# Altium schematic sheet Y.SchDoc
size A4
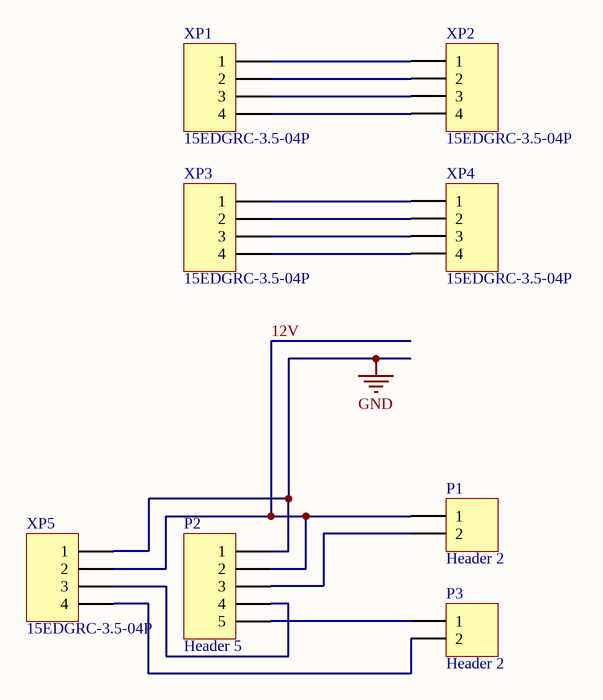
[diagram p0: Y.SchDoc]

## Parts
P1  Header 2  [HDR1X2]
P2  Header 5  [HDR1X5]
P3  Header 2  [HDR1X2]
XP1  15EDGRC-3.5-04P  [RR_CONN_15EDGRC-3.5-04P]
XP2  15EDGRC-3.5-04P  [RR_CONN_15EDGRC-3.5-04P]
XP3  15EDGRC-3.5-04P  [RR_CONN_15EDGRC-3.5-04P]
XP4  15EDGRC-3.5-04P  [RR_CONN_15EDGRC-3.5-04P]
XP5  15EDGRC-3.5-04P  [RR_CONN_15EDGRC-3.5-04P]

## Nets
GND: P2.1 XP5.1
12V: P1.1 P2.2 XP5.2
NetP1_2: P1.2 P2.3
NetP2_4: P2.4 XP5.3
NetP2_5: P2.5 P3.1
NetP3_2: P3.2 XP5.4
NetXP1_1: XP1.1 XP2.1
NetXP1_2: XP1.2 XP2.2
NetXP1_3: XP1.3 XP2.3
NetXP1_4: XP1.4 XP2.4
NetXP3_1: XP3.1 XP4.1
NetXP3_2: XP3.2 XP4.2
NetXP3_3: XP3.3 XP4.3
NetXP3_4: XP3.4 XP4.4

## Library data of the parts
P1 P3 = Header 2: Header, 2-Pin; LatestRevisionDate: 17-Jul-2002; LatestRevisionNote: Re-released for DXP Platform.; Publisher: Altium Limited
P2 = Header 5: Header, 5-Pin; LatestRevisionDate: 17-Jul-2002; LatestRevisionNote: Re-released for DXP Platform.; Publisher: Altium Limited
XP1-XP5 = 15EDGRC-3.5-04P: CONN 15EDGRC-3.5-04P R-HEADER; Manufacturer: DEGSON ELECTRONICS; Order Number: 15EDGRC-3.5-04P-14-00A(H); Value: Pluggable terminal block; 3.5mm; ways:4; angled 90°; socket; male; Cost: 0,32; Package: 4x3.5MM pitch